# EAGLE design Power-Ckt (EAGLE 7.7.0)
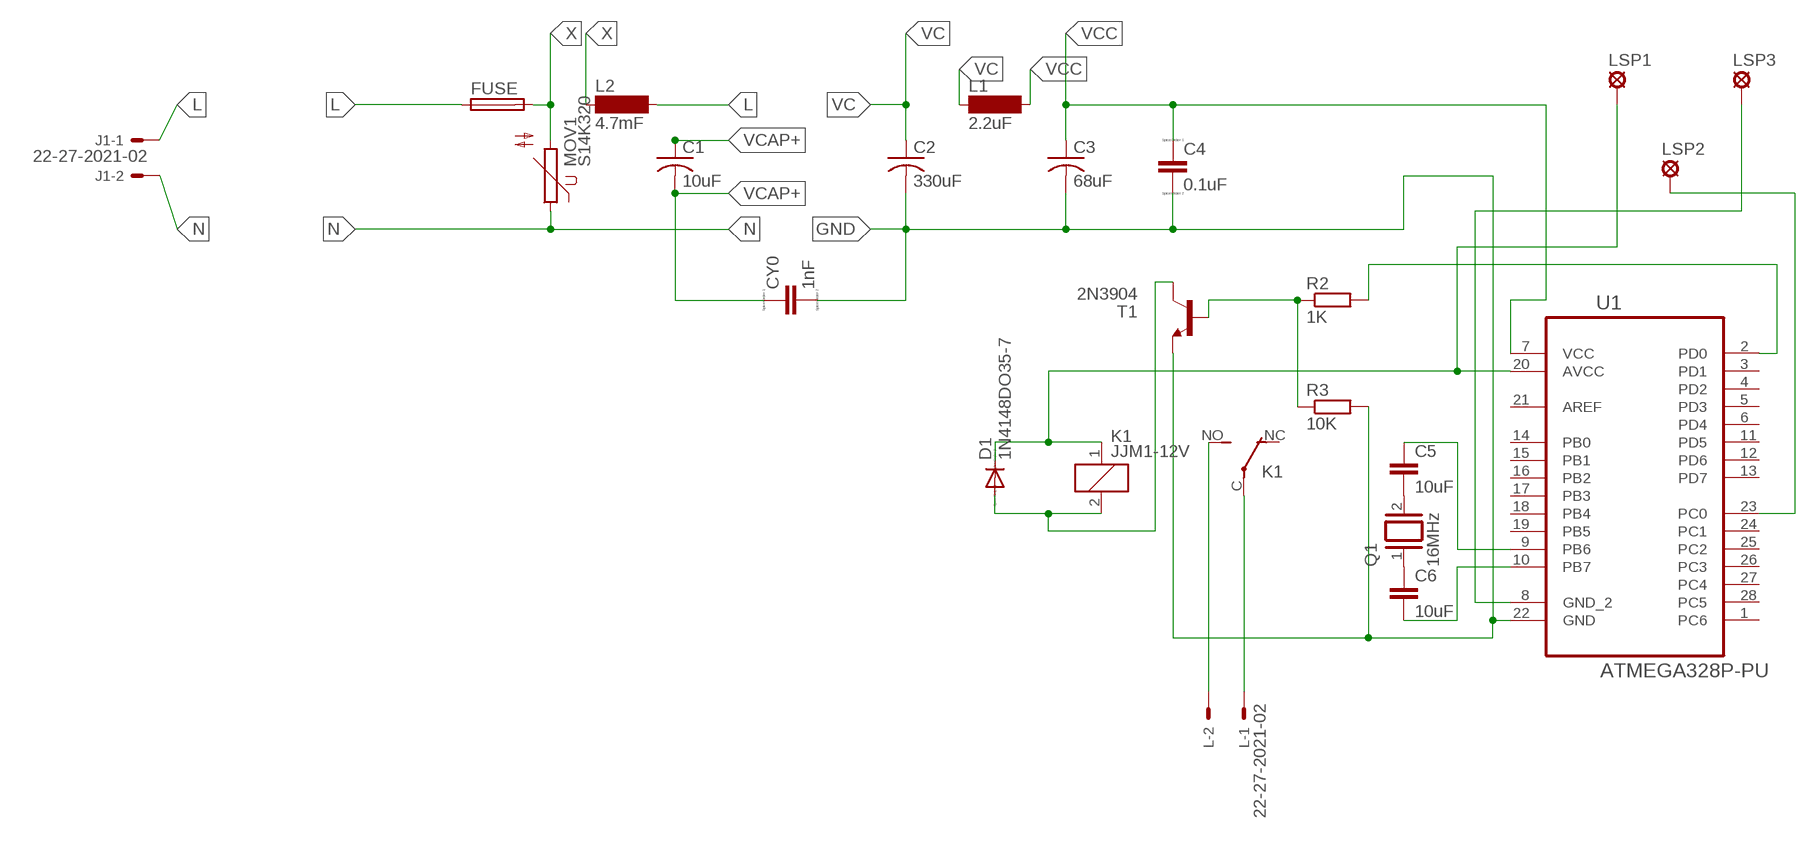
[diagram p0: schematic, sheet 1]

## Parts
C1  10uF  C-USC0805K  [C0805K]
C2  330uF  C-USC0805K  [C0805K]
C3  68uF  C-USC0805K  [C0805K]
C4  0.1uF  CC1808  [C1808]
C5  10uF  C2,5-3  [C2.5-3]
C6  10uF  C2,5-3  [C2.5-3]
CY0  1nF  CC1808  [C1808]
D1  1N4148DO35-7  [DO35-7]
FUSE  GSH15  [GSH15]
J1  22-27-2021-02  [6410-02]
K1  JJM1-12V  [JJM1C]
L  22-27-2021-02  [6410-02]
L1  2.2uF  SM-1206  [SM-1206]
L2  4.7mF  SM-1206  [SM-1206]
LSP1  LSP13  [LSP13]
LSP2  LSP13  [LSP13]
LSP3  LSP13  [LSP13]
MOV1  S14K320  [S14K320]
Q1  16MHz  XTAL/S  [QS]
R2  1K  R-EU_0204/5  [0204/5]
R3  10K  R-EU_0204/5  [0204/5]
T1  2N3904  [TO92]
U1  ATMEGA328P-PU  [DIP254P762X457-28]

## Nets
GND: C2.2 C3.2 C4.2 CY0.2 R3.2 T1.3(E) U1.22(GND)
L: FUSE.1 J1.1 L2.2
N: J1.2 MOV1.1
N$2: R2.2 U1.2(PD0)
N$3: C5.2 Q1.2
N$4: C6.1 Q1.1
N$5: C5.1 U1.9(PB6)
N$6: C6.2 U1.10(PB7)
N$7: LSP2.MP U1.23(PC0)
N$8: D1.C K1.1 LSP1.MP U1.20(AVCC)
N$9: LSP3.MP U1.8(GND_2)
N$11: K1.NO(2:S) L.2
N$12: K1.C(2:P) L.1
N$13: R2.1 R3.1 T1.2(B)
N$14: D1.A K1.2 T1.1(C)
VC: C2.1 L1.1
VCAP+: C1.1
VCAP-: C1.2 CY0.1
VCC: C3.1 C4.1 L1.2 U1.7(VCC)
X: FUSE.2 L2.1 MOV1.2
Unconnected: K1.NC(2:O) U1.1(PC6) U1.3(PD1) U1.4(PD2) U1.5(PD3) U1.6(PD4) U1.11(PD5) U1.12(PD6) U1.13(PD7) U1.14(PB0) U1.15(PB1) U1.16(PB2) U1.17(PB3) U1.18(PB4) U1.19(PB5) U1.21(AREF) U1.24(PC1) U1.25(PC2) U1.26(PC3) U1.27(PC4) U1.28(PC5)

## Library data of the parts
C1-C3 = rcl:C-US: CAPACITOR, American symbol
C4 CY0 = eagle-ltspice:C: CAPACITOR, European symbol; SPICEMODEL: NONE; SPICEPREFIX: C
C5 C6 = capacitor-wima:C: CAPACITOR naming: grid - package width
D1 = diode:1N4148: DIODE high speed (Philips)
FUSE = fuse:GSH15: FUSE HOLDER grid 15mm, 19649 Wickmann; MPN: 64900001039; OC_FARNELL: 1271673; OC_NEWARK: 02P0318
J1 L = con-molex:22-?-02: CONNECTOR wire to board 2.54 mm (.1 inch) pitch header; OC_FARNELL: unknown; OC_NEWARK: unknown
K1 = relay:JJM1-12V: HALF-SIZE AUTOMOTIVE RELAY NAiS Source: http://www.mew-europe.com/.. en_ds_61210_0001.pdf; MF: AROMAT/ MATSUSHITA; MPN: JJM1-12V; OC_FARNELL: unknown; OC_NEWARK: 10C7318
L1 L2 = inductor-neosid:SM-1206: INDUCTOR SMD chip inductor; OC_FARNELL: unknown; OC_NEWARK: unknown
LSP1-LSP3 = solpad:LSP13: SOLDER PAD drill 1.3 mm, distributor Buerklin, 12H562
MOV1 = varistor:S14K320: VARISTOR
Q1 = special:XTAL/S: CRYSTAL
R2 R3 = resistor:R-EU_: RESISTOR, European symbol
T1 = transistor:2N3904: NPN TRANSISTOR
U1 = ATMEGA328P-PU:ATMEGA328P-PU: 8-bit Microcontroller with In-System Programmable Flash; AVAILABILITY: Good; DESCRIPTION: Embedded microcontroller ATMEGA328P-PU PDIP 28 Microchip Technology 8-Bit 20 MHz I/O number 23; MF: Microchip; MP: ATMEGA328P-PU; PACKAGE: SPDIP-28 Microchip; PRICE: 2.69 USD

## Board
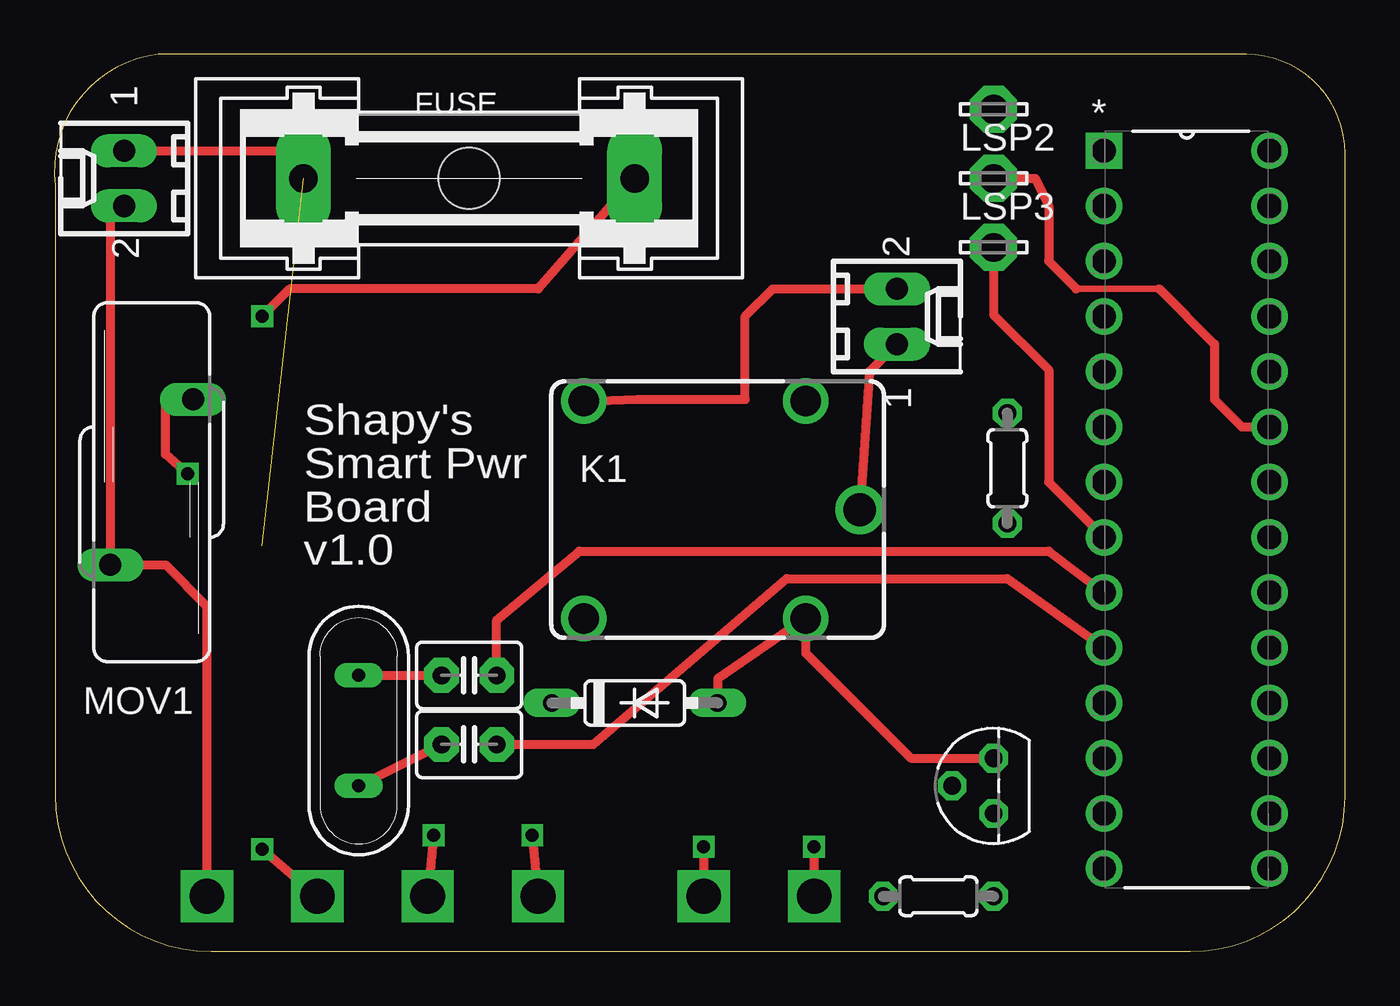
[diagram p1: board, top side]
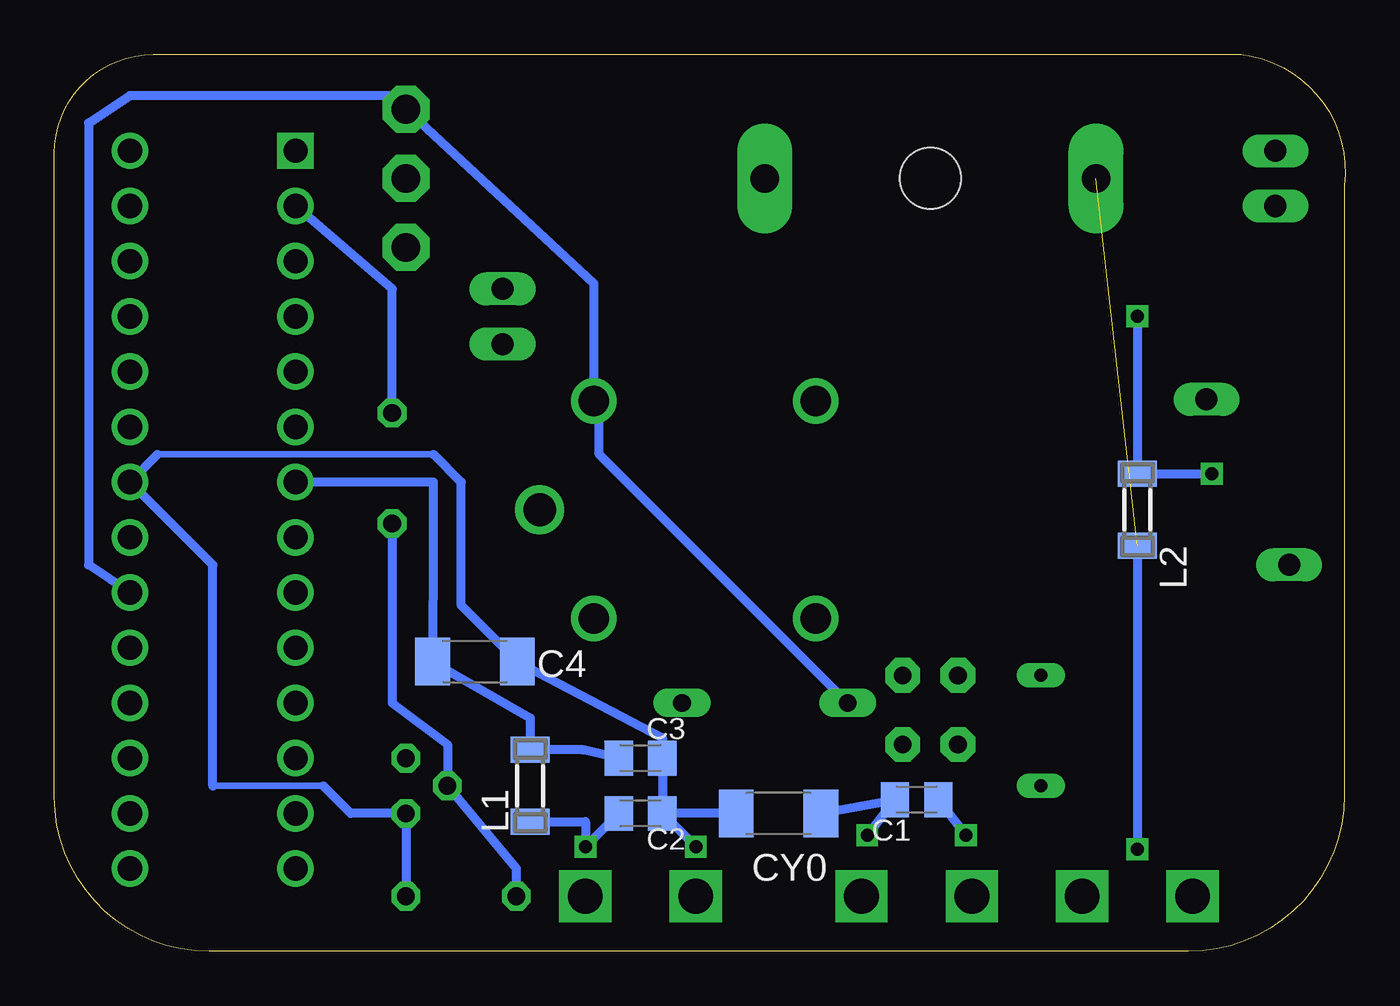
[diagram p2: board, bottom side, seen from below]

Size 59.4 x 41.27 mm. Coordinates in mm from the lower left corner, seen from the top.
Outline: 54.85,41.27 4.78,41.27 arc90 0.04,35.25 0.04,7.18 arc90 7.22,0 52.27,0 arc90 59.4,7.12 59.4,36.72 arc90 54.85,41.27
Copper layers (1*16): Top 0.035mm / dielectric 1.5mm / Bottom 0.035mm
Design rules "default": minimum track width 10mil, minimum drill 24mil, track to track 8mil, track to pad 8mil, pad to pad 8mil, via to via 8mil, smd to smd 8mil, copper to edge 40mil, drill to drill 8mil, minimum pad ring 10mil, minimum via ring 8mil, stop-mask expansion 4mil, vias tented up to drill 0mil, thermal gap 10mil

### Footprints (pad centres in the part's own frame; a part is rotated, then mirrored left to right if it is on the bottom)
C0805K = smd 1.3 x 1.6: 1 -1,0; 2 1,0
C1808 = smd 1.6 x 2.2: 1 -1.95,0; 2 1.95,0
C2.5-3 = drill 0.813 pad 1.6 octagon: 1 -1.27,0; 2 1.27,0
DO35-7 = drill 0.813 long: A 3.81,0; C -3.81,0
GSH15 = drill 1.321 pad 2.54 long: 1 -7.62,0; 2 7.62,0 | hole 2.794: 0,0
6410-02 = drill 1.016 long: 1 1.27,0; 2 -1.27,0
JJM1C = drill 1.4: 1 4.05,5; 2 4.05,-5; NC -6.15,-5; NO -6.15,5 | drill 1.5: C 6.55,0
SM-1206 = smd 1.2 x 1.8: 1 -1.65,0; 2 1.65,0
LSP13 = drill 1.321 pad 2.159 octagon: MP 0,0
S14K320 = drill 1.016 long: 1 -1.905,-3.81; 2 1.905,3.81
QS = drill 0.61 long: 1 -2.54,0; 2 2.54,0
0204/5 = drill 0.813 octagon: 1 -2.54,0; 2 2.54,0
TO92 = drill 0.813 octagon: 1 1.27,0; 2 0,1.905; 3 -1.27,0
DIP254P762X457-28 = drill 1.118 square: 1 -7.62,33.02 | drill 1.118: 2 -7.62,30.48; 3 -7.62,27.94; 4 -7.62,25.4; 5 -7.62,22.86; 6 -7.62,20.32; 7 -7.62,17.78; 8 -7.62,15.24; 9 -7.62,12.7; 10 -7.62,10.16; 11 -7.62,7.62; 12 -7.62,5.08; 13 -7.62,2.54; 14 -7.62,0; 15 0,0; 16 0,2.54; 17 0,5.08; 18 0,7.62; 19 0,10.16; 20 0,12.7; 21 0,15.24; 22 0,17.78; 23 0,20.32; 24 0,22.86; 25 0,25.4; 26 0,27.94; 27 0,30.48; 28 0,33.02

### Placement (x,y rotation side)
C1  19.72,6.99 180 bottom
C2  32.42,6.35 0 bottom
C3  32.42,8.89 0 bottom
C4  40.04,13.34 0 bottom
C5  19.09,12.7 180 top
C6  19.09,9.53 0 top
CY0  26.07,6.35 180 bottom
D1  26.71,11.43 0 top
FUSE  19.09,35.56 0 top
J1  3.21,35.56 90 top
K1  30.52,20.32 0 top
L  38.77,29.21 270 top
L1  37.5,7.62 90 bottom
L2  9.56,20.32 270 bottom
LSP1  43.22,38.73 0 top
LSP2  43.22,35.56 0 top
LSP3  43.22,32.38 0 top
MOV1  4.48,21.59 0 top
Q1  14.01,10.16 90 top
R2  43.85,22.23 90 top
R3  40.68,2.54 0 top
T1  43.22,7.62 90 top
U1  55.92,3.81 0 top

### Tracks (layer width: path | path; a pad name or v marks a point on that pad's centre or on a via)
GND  (via drill 0.6, 1.6)
  Top 0.406: v29.88,4.81 v29.88,2.54
  Bottom 0.305: 41.95,22.86 54.65,22.86 | 47.03,7.62 52.11,7.62
  Bottom 0.406: CY0.2 C2.2 | C2.2 C3.2 31.42,9.84 C4.2 40.68,15.92 40.68,21.59 41.95,22.86 | C2.2 v29.88,4.81 | R3.2 T1.3 45.76,6.35 47.03,7.62 | 54.65,22.86 U1.22 52.11,17.78 52.11,7.62
L  (via drill 0.6, 1.6)  (1 unrouted)
  Top 0.406: v9.56,4.7 v12.1,2.54 | J1.1 11.47,36.83 FUSE.1
  Bottom 0.406: L2.2 v9.56,4.7
N  (via drill 1.6)
  Top 0.406: J1.2 2.58,33.66 MOV1.1 5.12,17.78 7.02,15.88 v7.02,2.54
N$2
  Bottom 0.406: R2.2 43.85,30.48 U1.2
N$3
  Top 0.406: Q1.2 C5.2
N$4
  Top 0.406: Q1.1 C6.1
N$5
  Top 0.406: C5.1 20.36,15.24 24.17,18.41 45.76,18.41 U1.9
N$6
  Top 0.406: C6.2 24.8,9.53 33.69,17.14 43.85,17.14 U1.10
N$7
  Top 0.305: 47.03,30.48 50.84,30.48
  Top 0.406: 50.84,30.48 53.38,27.94 53.38,25.4 54.65,24.13 U1.23 | LSP2.MP 45.12,35.56 45.76,34.29 45.76,31.75 47.03,30.48
N$8
  Bottom 0.406: U1.20 57.82,17.78 57.82,38.1 55.92,39.37 43.85,39.37 LSP1.MP 34.57,30.72 K1.1 34.33,25.08 34.33,22.86 D1.C
N$9
  Top 0.406: U1.8 45.76,21.59 45.76,26.75 43.22,29.29 LSP3.MP
N$11
  Top 0.406: K1.NO 26.83,25.4 31.79,25.4 31.79,29.21 33.06,30.48 L.2
N$12
  Top 0.406: L.1 37.5,26.67 K1.C
N$13
  Bottom 0.406: R3.1 38.14,3.81 T1.2 41.31,9.53 43.85,11.43 R2.1
N$14
  Top 0.406: D1.A 30.52,12.54 K1.2 34.57,13.73 39.41,8.89 T1.1
VC  (via drill 0.6, 1.6)
  Top 0.406: v34.96,4.81 v34.96,2.54
  Bottom 0.406: C2.1 v34.96,4.81 34.96,5.97 L1.1
VCAP+  (via drill 0.6, 1.6)
  Top 0.406: v17.45,5.35 v17.18,2.54
  Bottom 0.406: C1.1 v17.45,5.35
VCAP-  (via drill 0.6, 1.6)
  Top 0.406: v21.99,5.35 v22.26,2.54
  Bottom 0.406: v21.99,5.35 C1.2 CY0.1
VCC
  Bottom 0.406: C3.1 35.07,9.27 L1.2 37.5,10.75 C4.1 41.95,17.1 41.95,21.59 U1.7
X  (via drill 0.6)
  Top 0.406: v6.13,21.97 5.12,22.86 5.12,25.4 MOV1.2 | FUSE.2 22.26,30.48 10.83,30.48 v9.56,29.21
  Bottom 0.406: v6.13,21.97 L2.1 v9.56,29.21

### Text on the board
tPlace: Shapy's / Smart Pwr / Board / v1.0